# Altium schematic sheet sherpa_1a_minimal_template.SchDoc
size A4
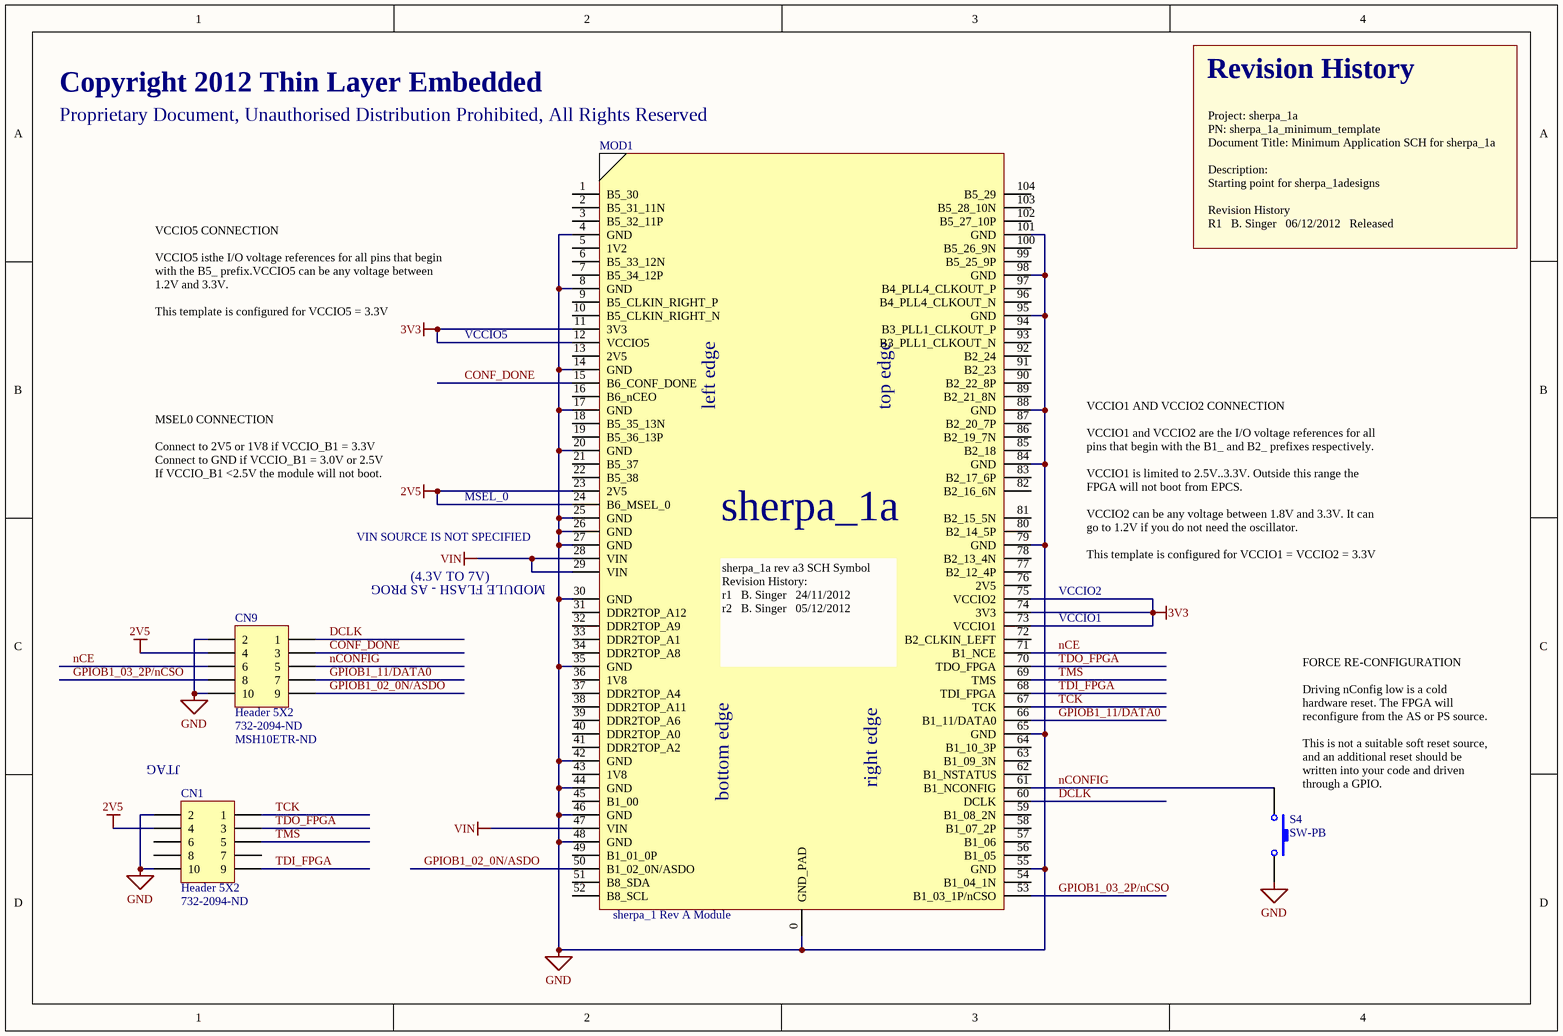
[diagram p0: sherpa_1a_minimal_template.SchDoc]

## Parts
CN1  Header 5X2  Supplier Part Number 1: 732-2094-ND  [BOXHDR2X5_SMT]
CN9  Header 5X2  Supplier Part Number 1: 732-2094-ND  Supplier Part Number 2: MSH10ETR-ND  [BOXHDR2X5_SMT]
MOD1  sherpa_1 Rev A Module  [MODULE]
S4  SW-PB  [TL1105_V]

## Nets
2V5: CN1.4 CN9.4 MOD1.23(2V5) MOD1.24(B6_MSEL_0)
3V3: MOD1.11(3V3) MOD1.12(VCCIO5) MOD1.73(VCCIO1) MOD1.74(3V3) MOD1.75(VCCIO2)
GND: CN1.2 CN1.10 CN9.2 CN9.10 MOD1.0(GND_PAD) MOD1.4(GND) MOD1.8(GND) MOD1.14(GND) MOD1.17(GND) MOD1.20(GND) MOD1.25(GND) MOD1.26(GND) MOD1.27(GND) MOD1.30(GND) MOD1.35(GND) MOD1.42(GND) MOD1.44(GND) MOD1.46(GND) MOD1.48(GND) MOD1.55(GND) MOD1.65(GND) MOD1.79(GND) MOD1.84(GND) MOD1.88(GND) MOD1.95(GND) MOD1.98(GND) MOD1.101(GND) S4.1
VIN: MOD1.28(VIN) MOD1.29(VIN) MOD1.47(VIN)
CONF_DONE: CN9.3 MOD1.15(B6_CONF_DONE)
DCLK: CN9.1 MOD1.60(DCLK)
GPIOB1_02_0N/ASDO: CN9.9 MOD1.50(B1_02_0N/ASDO)
GPIOB1_03_2P/nCSO: CN9.8 MOD1.53(B1_03_1P/nCSO)
GPIOB1_11/DATA0: CN9.7 MOD1.66(B1_11/DATA0)
nCE: CN9.6 MOD1.71(B1_NCE)
nCONFIG: CN9.5 MOD1.61(B1_NCONFIG) S4.2
TCK: CN1.1 MOD1.67(TCK)
TDI_FPGA: CN1.9 MOD1.68(TDI_FPGA)
TDO_FPGA: CN1.3 MOD1.70(TDO_FPGA)
TMS: CN1.5 MOD1.69(TMS)

Not connected (* = marked no-connect by the designer): CN1 6 7 8; MOD1 1(B5_30) 2(B5_31_11N) 3(B5_32_11P) 5(1V2) 6(B5_33_12N) 7(B5_34_12P) 9(B5_CLKIN_RIGHT_P) 10(B5_CLKIN_RIGHT_N) 13(2V5) 16(B6_nCEO) 18(B5_35_13N) 19(B5_36_13P) 21(B5_37) 22(B5_38) 31(DDR2TOP_A12) 32(DDR2TOP_A9) 33(DDR2TOP_A1) 34(DDR2TOP_A8) 36(1V8) 37(DDR2TOP_A4) 38(DDR2TOP_A11) 39(DDR2TOP_A6) 40(DDR2TOP_A0) 41(DDR2TOP_A2) 43(1V8) 45(B1_00) 49(B1_01_0P) 51(B8_SDA) 52(B8_SCL) 54(B1_04_1N) 56(B1_05) 57(B1_06) 58(B1_07_2P) 59(B1_08_2N) 62(B1_NSTATUS) 63(B1_09_3N) 64(B1_10_3P) 72(B2_CLKIN_LEFT) 76(2V5) 77(B2_12_4P) 78(B2_13_4N) 80(B2_14_5P) 81(B2_15_5N) 82(B2_16_6N) 83(B2_17_6P) 85(B2_18) 86(B2_19_7N) 87(B2_20_7P) 89(B2_21_8N) 90(B2_22_8P) 91(B2_23) 92(B2_24) 93(B3_PLL1_CLKOUT_N) 94(B3_PLL1_CLKOUT_P) 96(B4_PLL4_CLKOUT_N) 97(B4_PLL4_CLKOUT_P) 99(B5_25_9P) 100(B5_26_9N) 102(B5_27_10P) 103(B5_28_10N) 104(B5_29)

## Notes on the sheet
- Copyright 2012 Thin Layer Embedded
- Revision History
- Proprietary Document, Unauthorised Distribution Prohibited, All Rights Reserved
- Project: sherpa_1a
  PN: sherpa_1a_minimum_template
  Document Title: Minimum Application SCH for sherpa_1a
  Description:
  Starting point for sherpa_1adesigns
  Revision History
  R1   B. Singer   06/12/2012   Released
- VCCIO5 CONNECTION
  VCCIO5 isthe I/O voltage references for all pins that begin with the B5_ prefix.VCCIO5 can be any voltage between 1.2V and 3.3V.
  This template is configured for VCCIO5 = 3.3V
- VCCIO5
- MSEL0 CONNECTION
  Connect to 2V5 or 1V8 if VCCIO_B1 = 3.3V
  Connect to GND if VCCIO_B1 = 3.0V or 2.5V
  If VCCIO_B1 <2.5V the module will not boot.
- MSEL_0
- VIN SOURCE IS NOT SPECIFIED
- (4.3V TO 7V)
- VCCIO1 AND VCCIO2 CONNECTION
  VCCIO1 and VCCIO2 are the I/O voltage references for all pins that begin with the B1_ and B2_ prefixes respectively.
  VCCIO1 is limited to 2.5V..3.3V. Outside this range the FPGA will not boot from EPCS.
  VCCIO2 can be any voltage between 1.8V and 3.3V. It can go to 1.2V if you do not need the oscillator.
  This template is configured for VCCIO1 = VCCIO2 = 3.3V
- (near CN9) MODULE FLASH - AS PROG
- VCCIO1
- VCCIO2
- (near CN1) JTAG
- (near S4) FORCE RE-CONFIGURATION
  Driving nConfig low is a cold hardware reset. The FPGA will reconfigure from the AS or PS source.
  This is not a suitable soft reset source, and an additional reset should be written into your code and driven through a GPIO.
- (in symbol sherpa_1 Rev A Module) left edge; top edge; sherpa_1a; sherpa_1a rev a3 SCH Symbol / Revision History: / r1   B. Singer   24/11/2012 / r2   B. Singer   05/12/2012 /; right edge; bottom edge

## Library data of the parts
CN1 CN9 = Header 5X2: Header, 5-Pin, Dual row; Manufacturer: Wurth Electronics Inc; Manufacturer Part Number: 61201021621; Description: BOX HEADER 2.54MM MALE STR 10POS; Connector Type: Header, Shrouded; Number of Positions: 10; Number of Positions Loaded: All; Pitch: 0.100" (2.54mm); LatestRevisionDate: 17-Jul-2002; LatestRevisionNote: Re-released for DXP Platform.; Publisher: Altium Limited; Supplier 1: Digi-Key; RoHS: RoHS Compliant; Category: Connectors, Interconnects; Stock 1: 324; Pricing 1: 1=0.97, 25=0.8052, 100=0.713, 250=0.63252, 500=0.575, 1000=0.46, 2500=0.4025, 5000=0.3335, 10000=0.3059 (USD); Contact Type: Male Pin; Number of Rows: 2; Row Spacing: 0.100" (2.54mm); Contact Mating Length: -; Mounting Type: Through Hole; Termination: Solder; Fastening Type: -; Features: -; Contact Finish: Gold; Contact Finish Thickness: -; Color: Black; Packaging: Tray; ComponentLink1URL: http://www.we-online.de/eican/media/pdf/6120xx21621.pdf; ComponentLink1Description: http://www.we-online.de/eican/media/pdf/6120xx21621.pdf; Supplier 2: Digi-Key
  CN1: Supplier Part Number 2: MSH10ETR-ND
S4 = SW-PB: Switch; Published: 24-Mar-1999; LatestRevisionDate: 17-Jul-2002; LatestRevisionNote: Re-released for DXP Platform.; PackageReference: SPST-2; Publisher: Altium Limited